# EAGLE design Logic Module V3 (EAGLE 9.5.1)
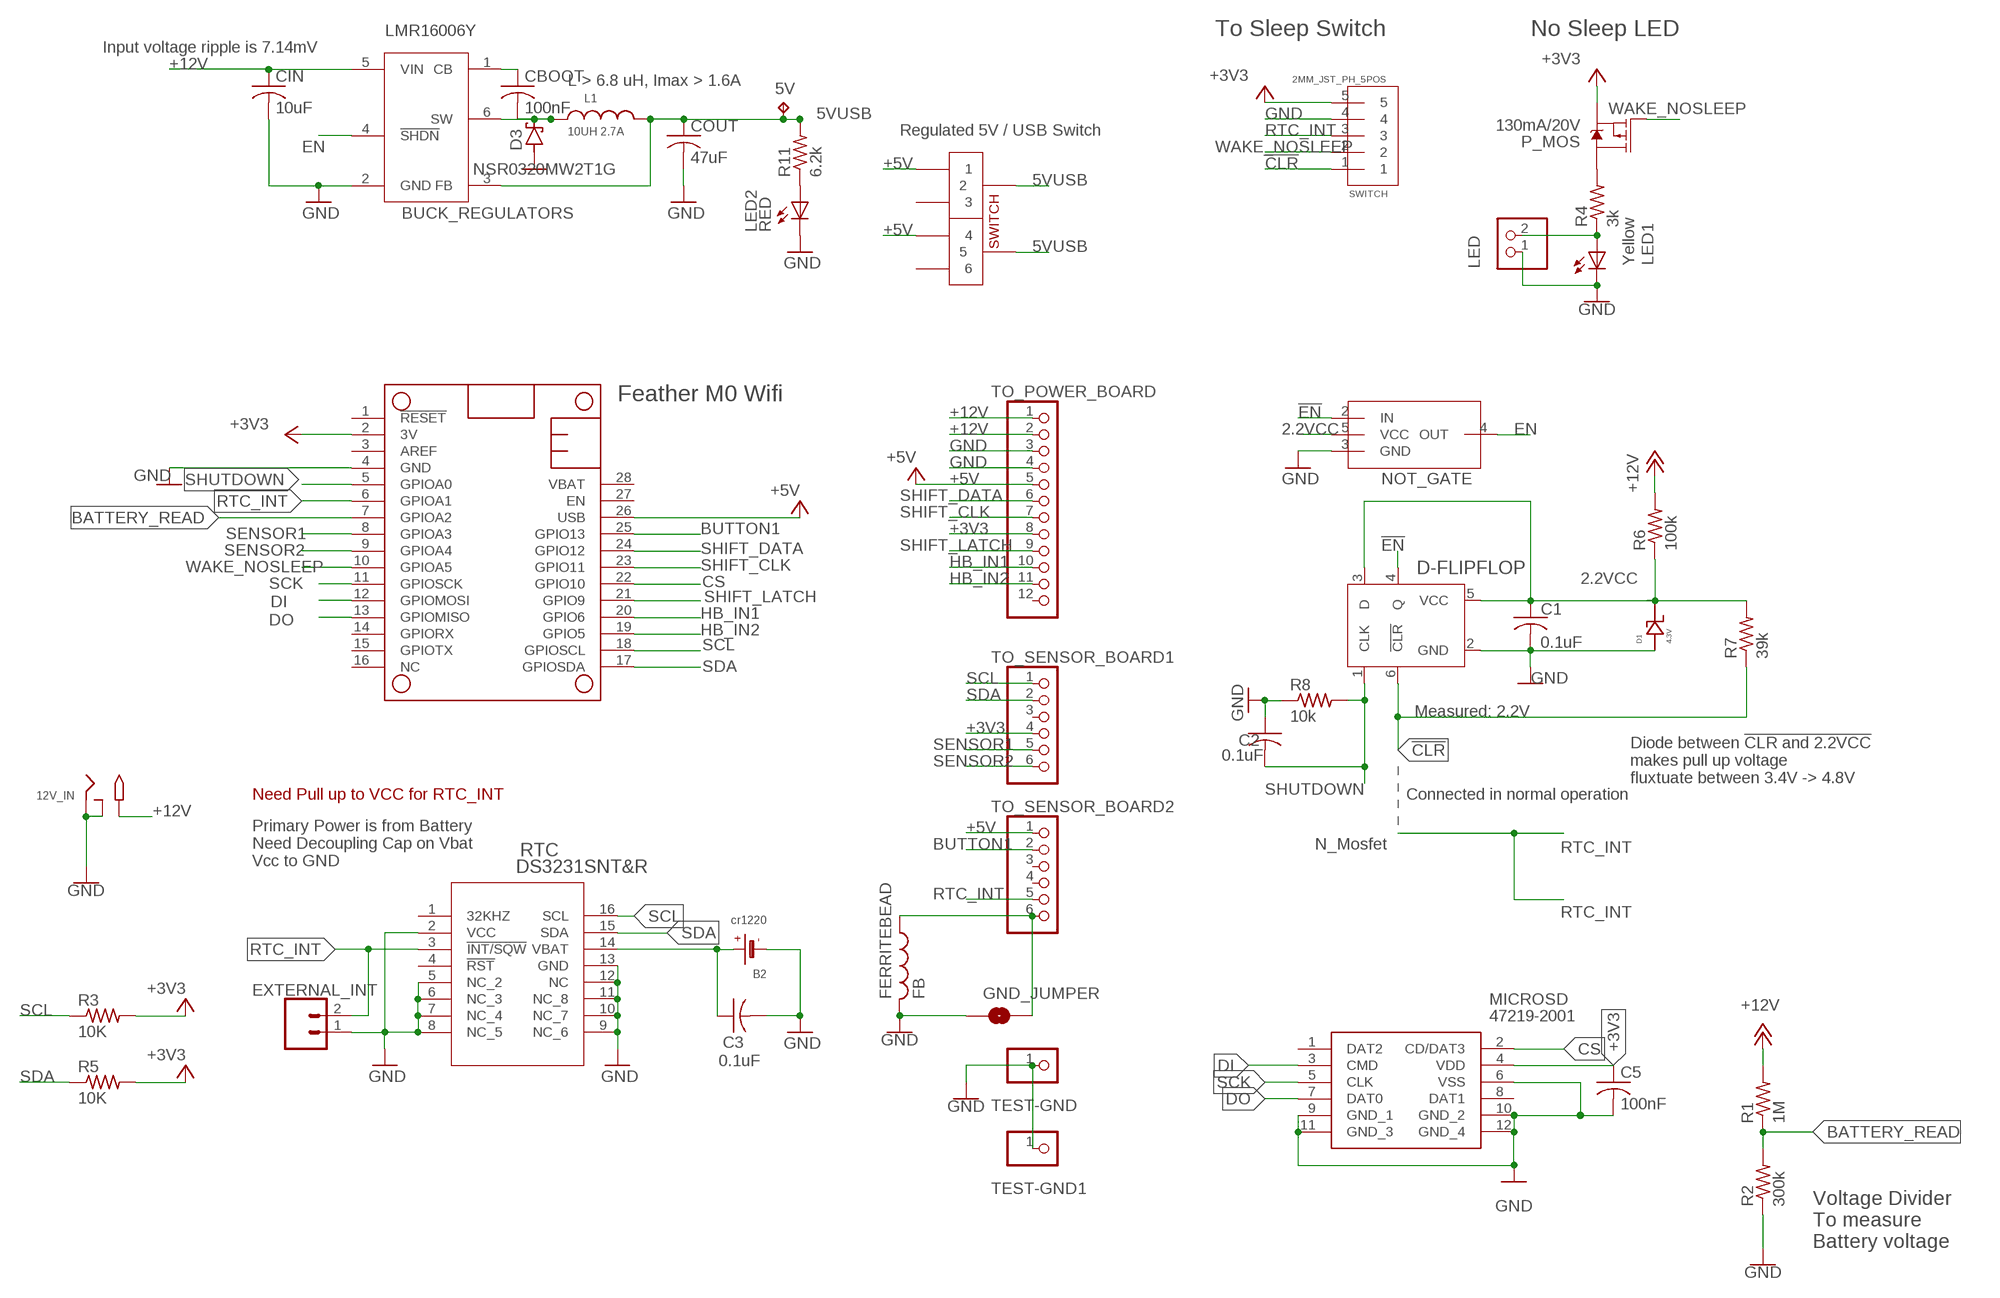
[diagram p0: schematic, sheet 1]

## Parts
5V  TPTP16R  [TP16R]
12V_IN  2.1MMJACKSMT  [DCJACK_2MM_SMT]
B2  cr1220  BATTERYCR1220_2  [CR1220-2]
C1  0.1uF  C-USC1206  [C1206]
C2  0.1uF  C-USC1206  [C1206]
C3  0.1uF  C-USC1206  [C1206]
C5  100nF  C-USC1206  [C1206]
CBOOT  100nF  C-USC1206  [C1206]
CIN  10uF  C-USC1206K  [C1206K]
COUT  47uF  C-USC1206  [C1206]
D1  4.3V  ZENER-DO219  [DO-219AC]
D3  NSR0320MW2T1G  BAT60J  [SOD323_ST]
D-FLIPFLOP  SN74LVC1G175DBVR  [DBV6]
EXTERNAL_INT  CONN_021X02_NO_SILK  [1X02_NO_SILK]
FERRITEBEAD  FB  [FB]
GND_JUMPER  JUMPER-SMT_2_NO_NO-SILK  [SMT-JUMPER_2_NO_NO-SILK]
L1  10UH 2.7A  WE-MAPI_4030_74438357100  [WE-MAPI_40XX]
LED  2.5MM_JST_UP_2POS  [JST_2POS_2.5MM_UP]
LED1  Yellow  LEDCHIPLED_0805  [CHIPLED_0805]
LED2  RED  LEDCHIPLED_0805  [CHIPLED_0805]
MICROSD  47219-2001  [472192001]
MS1  FEATHERWING  [FEATHERWING]
P_MOS  130mA/20V  MOSFET_PCH-IRLML2244  [SOT23-3]
R1  1M  R-US_R1206  [R1206]
R2  300k  R-US_R1206  [R1206]
R3  10K  R-US_R1206  [R1206]
R4  3k  R-US_R1206  [R1206]
R5  10K  R-US_R1206  [R1206]
R6  100k  R-US_R1206  [R1206]
R7  39k  R-US_R1206  [R1206]
R8  10k  R-US_R1206  [R1206]
R11  6.2k  WSLP1206R0500FEA  [RES_1206]
RTC  DS3231SNT&R  [21-0042B_16]
SWITCH  2MM_JST_PH_5POS  [2MM_5POS_HEADER]
TEST-GND  PINHD-1X1  [1X01]
TEST-GND1  PINHD-1X1  [1X01]
TO_POWER_BOARD  PINHD-1X12  [1X12]
TO_SENSOR_BOARD1  PINHD-1X6CB  [1X06-CLEANBIG]
TO_SENSOR_BOARD2  PINHD-1X6CB  [1X06-CLEANBIG]
U$1  2PDT_SWITCHJS-SMD  [JS-DPDT-SMD]
U$3  NOT_GATE  [SOT753]
VREG  BUCK_REGULATORS  [SOT23-6]

## Nets
2.2VCC [sig]: C1.1 D1.FNT D-FLIPFLOP.3(D) D-FLIPFLOP.5(VCC) R6.1 R7.2 U$3.5(VCC)
5VUSB: 5V.TP COUT.1 L1.2 R11.2 U$1.P$2 U$1.P$5 VREG.3(FB)
!CLR: D-FLIPFLOP.6(!CLR) R7.1 SWITCH.1
!EN: D-FLIPFLOP.4(Q) U$3.2(IN)
+3V3: C5.1 MICROSD.4(VDD) MS1.2(3V) P_MOS.2(S) R3.2 R5.2 SWITCH.5 TO_POWER_BOARD.8 TO_SENSOR_BOARD1.4
+5V: MS1.26(USB) TO_POWER_BOARD.5 TO_SENSOR_BOARD2.1 U$1.P$1 U$1.P$4
+12V [12v]: 12V_IN.PWR2(TIP) CIN.1 R1.2 R6.2 TO_POWER_BOARD.1 TO_POWER_BOARD.2 VREG.5(VIN)
BATTERY_READ: MS1.7(GPIOA2) R1.1 R2.2
BUTTON1: MS1.25(GPIO13) TO_SENSOR_BOARD2.2
CS: MICROSD.2(CD/DAT3) MS1.22(GPIO10)
DI: MICROSD.3(CMD) MS1.12(GPIOMOSI)
DO: MICROSD.7(DAT0) MS1.13(GPIOMISO)
EN: U$3.4(OUT) VREG.4(!SHDN)
GND: 12V_IN.GND(RING) 12V_IN.GNDBREAK(RING_SW) B2.- C1.2 C2.1 C3.2 C5.2 CIN.2 COUT.2 D1.BCK D3.A D-FLIPFLOP.2(GND) EXTERNAL_INT.1 FERRITEBEAD.P$2 GND_JUMPER.1 LED1.C LED2.C LED.1 MICROSD.6(VSS) MICROSD.9(GND_1) MICROSD.10(GND_2) MICROSD.11(GND_3) MICROSD.12(GND_4) MS1.4(GND) R2.1 R8.1 RTC.2(VCC) RTC.5(NC_2) RTC.6(NC_3) RTC.7(NC_4) RTC.8(NC_5) RTC.9(NC_6) RTC.10(NC_7) RTC.11(NC_8) RTC.12(NC) RTC.13(GND) SWITCH.4 TEST-GND1.1 TEST-GND.1 TO_POWER_BOARD.3 TO_POWER_BOARD.4 U$3.3(GND) VREG.2(GND)
HB_IN1: MS1.20(GPIO6) TO_POWER_BOARD.10
HB_IN2: MS1.19(GPIO5) TO_POWER_BOARD.11
N$1: B2.+ C3.1 RTC.14(VBAT)
N$2: P_MOS.3(D) R4.2
N$3: LED1.A LED.2 R4.1
N$6: FERRITEBEAD.P$1 GND_JUMPER.2 TO_SENSOR_BOARD2.6
N$12: LED2.A R11.1
N$16: CBOOT.1 VREG.1(CB)
N$17: CBOOT.2 D3.C L1.1 VREG.6(SW)
RTC_INT: EXTERNAL_INT.2 MS1.6(GPIOA1) RTC.3(!INT/SQW) SWITCH.3 TO_SENSOR_BOARD2.5
SCK: MICROSD.5(CLK) MS1.11(GPIOSCK)
SCL: MS1.18(GPIOSCL) R3.1 RTC.16(SCL) TO_SENSOR_BOARD1.1
SDA: MS1.17(GPIOSDA) R5.1 RTC.15(SDA) TO_SENSOR_BOARD1.2
SENSOR1: MS1.8(GPIOA3) TO_SENSOR_BOARD1.5
SENSOR2: MS1.9(GPIOA4) TO_SENSOR_BOARD1.6
SHIFT_CLK: MS1.23(GPIO11) TO_POWER_BOARD.7
SHIFT_DATA: MS1.24(GPIO12) TO_POWER_BOARD.6
SHIFT_LATCH: MS1.21(GPIO9) TO_POWER_BOARD.9
SHUTDOWN: C2.2 D-FLIPFLOP.1(CLK) MS1.5(GPIOA0) R8.2
WAKE_NOSLEEP: MS1.10(GPIOA5) P_MOS.1(G) SWITCH.2
Unconnected: MICROSD.1(DAT2) MICROSD.8(DAT1) MS1.1(!RESET) MS1.3(AREF) MS1.14(GPIORX) MS1.15(GPIOTX) MS1.16(NC) MS1.27(EN) MS1.28(VBAT) RTC.1(32KHZ) RTC.4(!RST) TO_POWER_BOARD.12 TO_SENSOR_BOARD1.3 TO_SENSOR_BOARD2.3 TO_SENSOR_BOARD2.4 U$1.P$3 U$1.P$6

## Notes on the sheet
- To Sleep Switch | No Sleep LED
- Input voltage ripple is 7.14mV
- L > 6.8 uH, Imax > 1.6A
- Regulated 5V / USB Switch
- Feather M0 Wifi
- Measured: 2.2V
- Diode between !CLR and 2.2VCC
  makes pull up voltage 
  fluxtuate between 3.4V -> 4.8V
- Need Pull up to VCC for RTC_INT | Connected in normal operation
- N_Mosfet
- Primary Power is from Battery
  Need Decoupling Cap on Vbat
  Vcc to GND
- Voltage Divider
  To measure 
  Battery voltage

## Library data of the parts
5V = testpad:TP: Test pad
12V_IN = adafruit:2.1MMJACK: 2.1mm x 5.5mm THM DC jack with internal switch. Digikey part #PJ-102A, 4UCON part #05537 2.1mm x 5.5mm SMT DC jack with internal switch. Digikey part #PJ-002A-SMT, 4UCON part #03267 By microbuilder.eu & adafruit.com
B2 = microbuilder:BATTERY: CR1220 SMT - Digikey: 3001K-ND CD2032 BAT-HLD-001 - Digikey: BAT-HLD-001-ND
C1-C3 = adafruit:C-US: CAPACITOR, American symbol
C5 = resistor:C-US: CAPACITOR, American symbol
CBOOT CIN COUT = rcl:C-US: CAPACITOR, American symbol; SPICEPREFIX: C
D1 = beach:ZENER-DO219
D3 = diode:BAT60J: Schottky barrier diode Source: www.st.com, BAT60J.pdf
D-FLIPFLOP = eDNA:SN74LVC1G175DBVR: D Flipflop with clear - https://www.digikey.com/product-detail/en/texas-instruments/SN74LVC1G175DBVR/296-17617-1-ND/706599; MANUFACTURER_PART_NUMBER: SN74LVC1G175DBVR; VENDOR: Texas Instruments
EXTERNAL_INT = SparkFun-Connectors:CONN_02: Multi connection point. Often used as Generic Header-pin footprint for 0.1 inch spaced/style header connections On any of the 0.1 inch spaced packages, you can populate with these: Break Away Headers - Straight <https://www.sparkfun.com/products/116> (PRT-00116) Break Away Male Headers - Right Angle <https://www.sparkfun.com/products/553> (PRT-00553) Female Headers <https://www.sparkfun.com/products/115> (PRT-00115) Break Away Headers - Machine Pin <https://www.sparkfun.com/products/117> (PRT-00117) Break Away Female Headers - Swiss Machine Pin <https://www.sparkfun.com/products/743> (PRT-00743) For SCREWTERMINALS and SPRING TERMINALS visit here: Screw Terimnals on SparkFun.com <https://www.sparkfun.com/search/results?term=Screw+Terminals> (5mm/3.5mm/2.54mm spacing) This device is also useful as a general connection point to wire up your design to another part of your project. Our various solder wires solder well into these plated through hole pads. Hook-Up Wire - Assortment (Stranded, 22 AWG) <https://www.sparkfun.com/products/11375> (PRT-11375) Hook-Up Wire - Assortment (Solid Core, 22 AWG) <https://www.sparkfun.com/products/11367> (PRT-11367) View the entire wire category on our website here <https://www.sparkfun.com/categories/141> Special notes: Molex polarized connector foot print use with: PRT-08233 with associated crimp pins and housings. 2.54_SCREWTERM for use with PRT-10571. 3.5mm Screw Terminal footprints for PRT-08084 5mm Screw Terminal footprints for use with PRT-08432
FERRITEBEAD = adafruit:FB: Ferrite bead Digikey #P9821BK-ND
GND_JUMPER = SparkFun-Jumpers:JUMPER-SMT_2_NO: Normally open jumper This jumper has two pads in close proximity to each other. Apply solder to close the connection. Round pads are easier to solder for beginners, but are a lot larger. SparkFun Product that uses the round pads: SparkFun EL Sequencer <https://www.sparkfun.com/products/12781>
L1 = EMCComponents (rev19e):WE-MAPI_4030: SMD Metal Alloy Power Inductor Characteristics Magnetic iron alloy allows high rated currents Compact design Magnetically shielded High current capability and handles high transient current spikes Low acoustic noise and low leakage flux noise Operating temperature: –40 °C to 125 °C Applications DC/DC-converter for high current power supplies DC/DC-converter for Field Programmable Gate Array (FPGA) POL-converters Portable power like PDA, digital camera Mainboards/graphic cards Battery powered devices Wireless communication devices Power supplies for smartphones, tablet PCs and other mobile devices <http://katalog.we-online.de/media/images/v2/Family_WE-MAPI.jpg> Details see: http://katalog.we-online.de/en/pbs/WE-MAPI? Updated by Dan Xu 2014-07-08 2014 (C) Wurth Elektronik; WE-NUMBER: 74438357100/10uH
LED = eDNA:2.5MM_JST_UP_2POS
LED1 LED2 = adafruit:LED: LED OSRAM: - CHIPLED LG R971, LG N971, LY N971, LG Q971, LY Q971, LO R971, LY R971 LH N974, LH R974 LS Q976, LO Q976, LY Q976 LO Q996 - Hyper CHIPLED LW Q18S LB Q993, LB Q99A, LB R99A - SideLED LS A670, LO A670, LY A670, LG A670, LP A670 LB A673, LV A673, LT A673, LW A673 LH A674 LY A675 LS A676, LA A676, LO A676, LY A676, LW A676 LS A679, LY A679, LG A679 - Hyper Micro SIDELED® LS Y876, LA Y876, LO Y876, LY Y876 LT Y87S - SmartLED LW L88C, LW L88S LB L89C, LB L89S, LG L890 LS L89K, LO L89K, LY L89K LS L896, LA L896, LO L896, LY L896 - TOPLED LS T670, LO T670, LY T670, LG T670, LP T670 LSG T670, LSP T670, LSY T670, LOP T670, LYG T670 LG T671, LOG T671, LSG T671 LB T673, LV T673, LT T673, LW T673 LH T674 LS T676, LA T676, LO T676, LY T676, LB T676, LH T676, LSB T676, LW T676 LB T67C, LV T67C, LT T67C, LS T67K, LO T67K, LY T67K, LW E67C LS E67B, LA E67B, LO E67B, LY E67B, LB E67C, LV E67C, LT E67C LW T67C LS T679, LY T679, LG T679 LS T770, LO T770, LY T770, LG T770, LP T770 LB T773, LV T773, LT T773, LW T773 LH T774 LS E675, LA E675, LY E675, LS T675 LS T776, LA T776, LO T776, LY T776, LB T776 LHGB T686 LT T68C, LB T68C - Hyper Mini TOPLED® LB M676 - Mini TOPLED Santana® LG M470 LS M47K, LO M47K, LY M47K Source: http://www.osram.convergy.de/
MICROSD = SamacSys_Parts:47219-2001: Molex 47219 Series 8 Way Horizontal Hinged Micro SD Memory Card Connector with Solder Termination Source: Datasheet <https://componentsearchengine.com/Datasheets/1/47219-2001.pdf>; DESCRIPTION: Molex 47219 Series 8 Way Horizontal Hinged Micro SD Memory Card Connector with Solder Termination; HEIGHT: mm; MANUFACTURER_NAME: Molex; MANUFACTURER_PART_NUMBER: 47219-2001; MOUSER_PART_NUMBER: 538-47219-2001; MOUSER_PRICE-STOCK: https://www.mouser.com/Search/Refine.aspx?Keyword=538-47219-2001
MS1 = adafruit:FEATHERWING
P_MOS = SparkFun-DiscreteSemi:MOSFET_PCH: P-channel MOSFETs Voltage controlled devices that allow control of high current outputs. SparkFun Products: SparkFun ESP32 Thing <https://www.sparkfun.com/products/13907> SparkFun ESP8266 Thing <https://www.sparkfun.com/products/13231>; PROD_ID: TRANS-11153; VALUE: 4.3A/20V/54mΩ
R1 R2 R6-R8 = adafruit:R-US_: RESISTOR, American symbol
R3 R5 = rcl:R-US_: RESISTOR, American symbol; SPICEPREFIX: R
R4 = resistor:R-US_: RESISTOR, American symbol
R11 = Resistor_Capacitor:WSLP1206R0500FEA: RES 0.05 OHM 1% 1W 1206 Manufacturer's datasheet <http://www.vishay.com/docs/30122/wslp.pdf>; CREATED_BY: PCBLayout.com; DIGIKEY_PART_NUMBER: WSLP-.05TR-ND; MANUFACTURER: Vishay Dale; MPN: WSLP1206R0500FEA; PACKAGE: SMD 1206
RTC = eDNA:DS3231SNT&R: Real-time clock, RTC, DS3231 https://www.digikey.com/products/en?keywords=DS3231SN%23T%26RCT-ND; MANUFACTURER_PART_NUMBER: DS3231SN#T&R; VENDOR: Maxim Integrated Products
SWITCH = eDNA:2MM_JST_PH_5POS: 5POS JST female, 5 position https://www.digikey.com/product-detail/en/jst-sales-america-inc/B5B-PH-K-S-LF-SN/455-1707-ND/926614
TEST-GND TEST-GND1 = adafruit:PINHD-1X1: Pin header 1x1 for 0.1" spacing With round pins
TO_POWER_BOARD = adafruit:PINHD-1X12: PIN HEADER
TO_SENSOR_BOARD1 TO_SENSOR_BOARD2 = adafruit:PINHD-1X6: PIN HEADER
U$1 = eDNA:2PDT_SWITCH: Double Pole Double Throw ON OFF ON switch. https://www.digikey.com/product-detail/en/e-switch/100DP1T1B1M2QEH/EG2400-ND/378869
U$3 = eDNA:NOT_GATE: Logic INVERTER, also known as NOT gate. SOT753 footprint. SOT753 version can be ordered from https://www.digikey.com/product-detail/en/toshiba-semiconductor-and-storage/TC4S584FLF/TC4S584FLFCT-ND/870444 Bao Nguyen - OpenSensingLab
VREG = eDNA:BUCK_REGULATORS

## Net classes
0 default: clearance 0.2 mm
1 12v: width 0.356 mm, clearance 0.254 mm
2 5v: width 0.406 mm, clearance 0.2 mm
3 sig: width 0.152 mm, clearance 0.2 mm

## Board
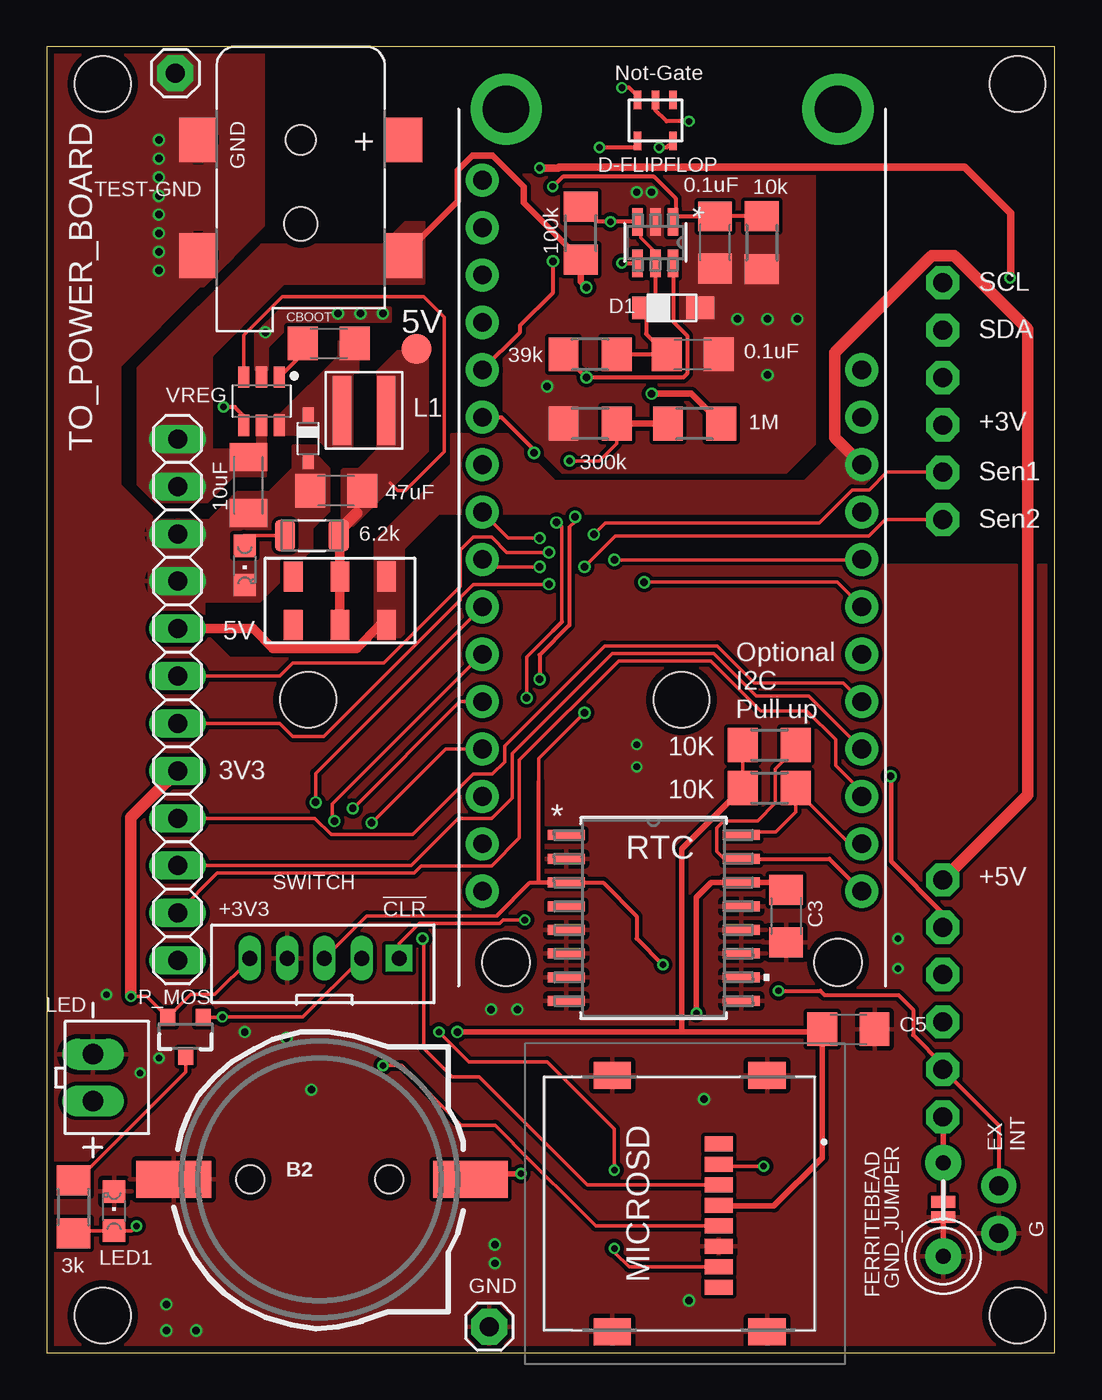
[diagram p1: board, top side]
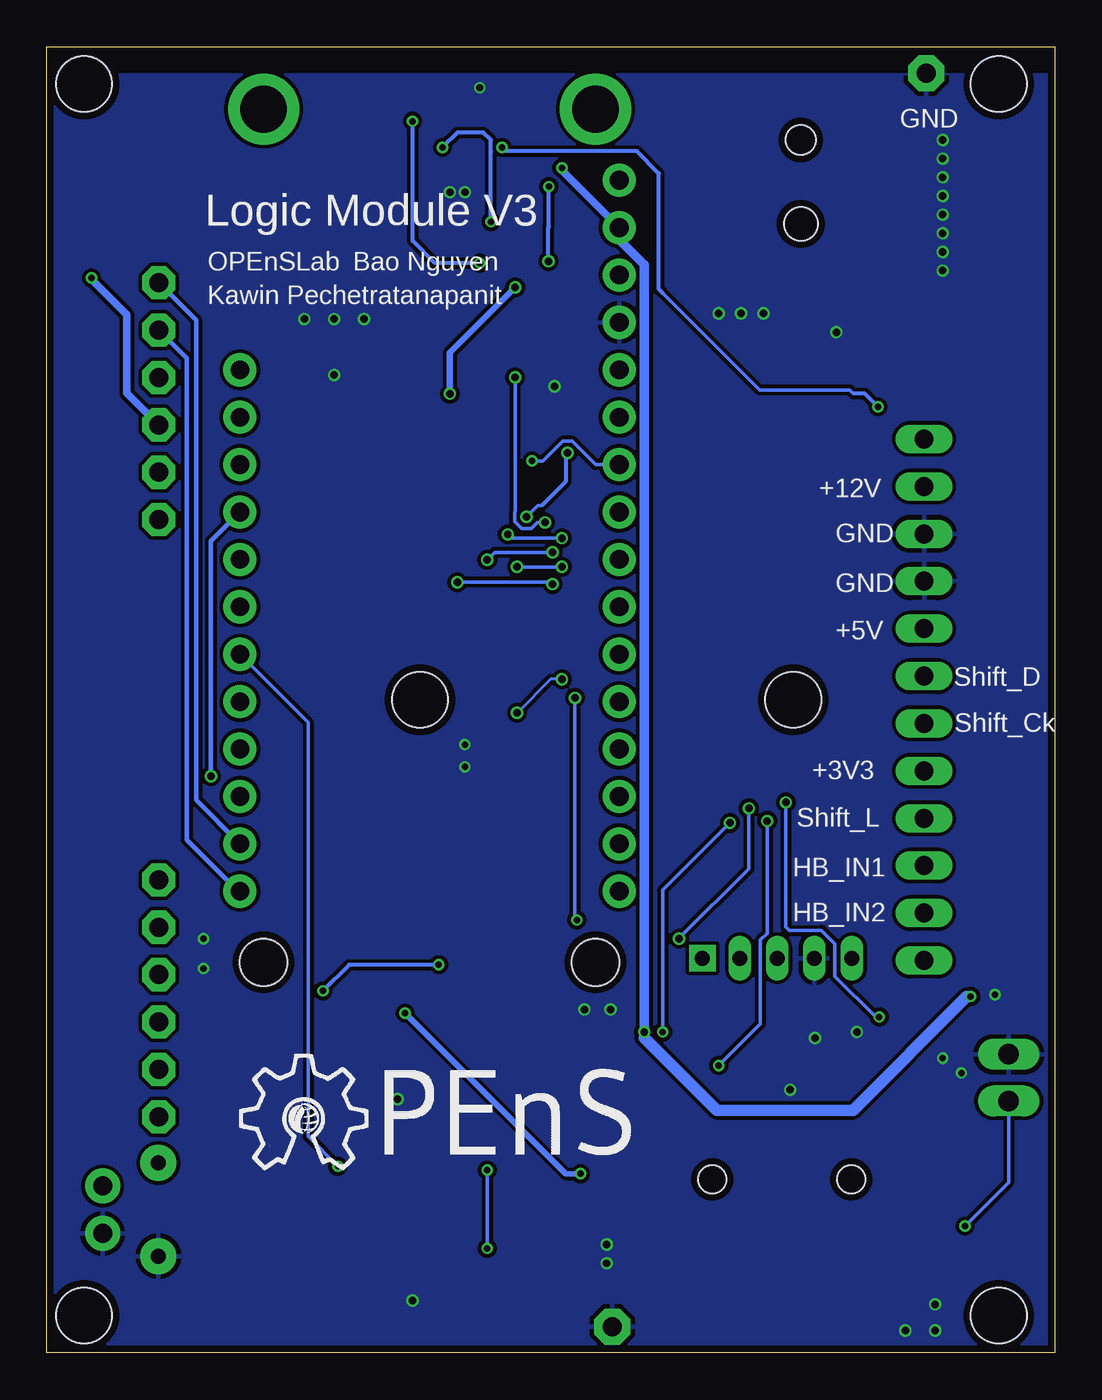
[diagram p2: board, bottom side, seen from below]

Size 54 x 70 mm. Coordinates in mm from the lower left corner, seen from the top.
Outline: 0,0 54,0 54,70 0,70 0,0
Copper layers (1*16): Top 0.035559375mm / dielectric 1.6mm / Bottom 0.035559375mm
Design rules "oshpark-2layer *": minimum track width 6mil, minimum drill 10mil, track to track 6mil, track to pad 6mil, pad to pad 6mil, via to via 6mil, smd to smd 6mil, copper to edge 15mil, drill to drill 6mil, minimum pad ring 5mil, minimum via ring 5mil, stop-mask expansion 2.5mil, vias tented up to drill 30mil, thermal gap 10mil
Holes 3 mm at 3,2 52,68 52,2 14,35 34,35 3,68

### Footprints (pad centres in the part's own frame; a part is rotated, then mirrored left to right if it is on the bottom)
TP16R = smd 1.6 x 1.6: TP 0,0
DCJACK_2MM_SMT = smd 2.4 x 2: GND 0,-5.5; GNDBREAK 6.2,-5.5; PWR1 0,5.5; PWR2 6.2,5.5 | hole 1.6: 0,0 | hole 1.8: 4.5,0
CR1220-2 = smd 4 x 2: + 8.29,0; - -7.6,0 | hole 1.5: 3.95,0; -3.5,0
C1206 = smd 1.6 x 1.8: 1 -1.4,0; 2 1.4,0
C1206K = smd 1.5 x 2: 1 -1.5,0; 2 1.5,0
DO-219AC = smd 1.5 x 1.2: BCK 2.9,0; FNT 0,0
SOD323_ST = smd 0.8 x 0.6: A 1.25,0; C -1.25,0
DBV6 = smd 1.473 x 0.559: 1 -1.118,0.95; 2 -1.118,0; 3 -1.118,-0.95; 4 1.118,-0.95; 5 1.118,0; 6 1.118,0.95
1X02_NO_SILK = drill 1.016 pad 1.88: 1 0,0; 2 2.54,0
FB = drill 0.8 pad 1.93: P$1 -2.5,0; P$2 2.5,0
SMT-JUMPER_2_NO_NO-SILK = smd 0.635 x 1.27: 1 -0.406,0; 2 0.406,0
WE-MAPI_40XX = smd 0.98 x 3.7: 1 -1.185,0; 2 1.185,0
JST_2POS_2.5MM_UP = drill 1.1 long: 1 -1.25,0; 2 1.25,0
CHIPLED_0805 = smd 1.2 x 1.2: A 0,-1.05; C 0,1.05
472192001 = smd 0.8 x 1.5: 1 3.205,-1.8; 2 2.105,-1.8; 3 1.005,-1.8; 4 -0.095,-1.8; 5 -1.195,-1.8; 6 -2.295,-1.8; 7 -3.395,-1.8; 8 -4.495,-1.8 | smd 1.45 x 2: 9 -6.875,-4.4; 10 -6.875,3.9; 11 6.875,3.9; 12 6.875,-4.4
FEATHERWING = drill 1 pad 1.778: 1 6.35,1.27; 2 8.89,1.27; 3 11.43,1.27; 4 13.97,1.27; 5 16.51,1.27; 6 19.05,1.27; 7 21.59,1.27; 8 24.13,1.27; 9 26.67,1.27; 10 29.21,1.27; 11 31.75,1.27; 12 34.29,1.27; 13 36.83,1.27; 14 39.37,1.27; 15 41.91,1.27; 16 44.45,1.27; 17 44.45,21.59; 18 41.91,21.59; 19 39.37,21.59; 20 36.83,21.59; 21 34.29,21.59; 22 31.75,21.59; 23 29.21,21.59; 24 26.67,21.59; 25 24.13,21.59; 26 21.59,21.59; 27 19.05,21.59; 28 16.51,21.59 | drill 2.5 pad 3.81: P$1 2.54,20.32; P$2 2.54,2.54 | hole 2.54: 48.26,20.32; 48.26,2.54
SOT23-3 = smd 0.8 x 0.9: 1 -0.95,-1; 2 0.95,-1; 3 0,1.1
R1206 = smd 1.6 x 1.803: 1 -1.422,0; 2 1.422,0
RES_1206 = smd 1.08 x 1.68: 1 -1.445,0; 2 1.445,0
21-0042B_16 = smd 1.981 x 0.533: 1 -4.686,4.445; 2 -4.686,3.175; 3 -4.686,1.905; 4 -4.686,0.635; 5 -4.686,-0.635; 6 -4.686,-1.905; 7 -4.686,-3.175; 8 -4.686,-4.445; 9 4.686,-4.445; 10 4.686,-3.175; 11 4.686,-1.905; 12 4.686,-0.635; 13 4.686,0.635; 14 4.686,1.905; 15 4.686,3.175; 16 4.686,4.445
2MM_5POS_HEADER = drill 0.8 pad 1.422 square: 1 -4,0 | drill 0.8 long: 2 -2,0; 3 0,0; 4 2,0; 5 4,0
1X01 = drill 1.016 pad 1.93 octagon: 1 0,0
1X12 = drill 1.016 long: 1 -13.97,0; 2 -11.43,0; 3 -8.89,0; 4 -6.35,0; 5 -3.81,0; 6 -1.27,0; 7 1.27,0; 8 3.81,0; 9 6.35,0; 10 8.89,0; 11 11.43,0; 12 13.97,0
1X06-CLEANBIG = drill 1.016 pad 1.778 octagon: 1 -6.35,0; 2 -3.81,0; 3 -1.27,0; 4 1.27,0; 5 3.81,0; 6 6.35,0
JS-DPDT-SMD = smd 1 x 1.6: P$1 0,0; P$2 2.5,0; P$3 5,0; P$4 0,2.6; P$5 2.5,2.6; P$6 5,2.6
SOT753 = smd 1 x 0.4: 1 -1.14,0.95; 2 -1.14,0; 3 -1.14,-0.95; 4 1.06,-0.95; 5 1.06,0.95
SOT23-6 = smd 1.146 x 0.597: 1 -1.287,0.95; 2 -1.287,0; 3 -1.287,-0.95; 4 1.287,-0.95; 5 1.287,0; 6 1.287,0.95

### Placement (x,y rotation side)
5V  19.8,53.8 0 top
12V_IN  13.6,65 270 top
B2  14.4,9.3 0 top
C1  34.6,53.5 0 top
C2  35.8,59.5 90 top
C3  39.6,23.4 270 top
C5  42.94,17.34 0 top
CBOOT  15.1,54.1 0 top
CIN  10.8,46.5 270 top
COUT  15.5,46.2 180 top
D1  32.1,56 0 top
D3  14,49 270 top
D-FLIPFLOP  32.6,59.5 270 top
EXTERNAL_INT  51,6.4 90 top
FERRITEBEAD  48.02,7.68 270 top
GND_JUMPER  48.02,7.68 90 top
L1  17,50.5 0 top
LED  2.46,14.75 270 top
LED1  3.6,7.6 0 top
LED2  10.6,42.2 180 top
MICROSD  34.19,8 90 top
MS1  22.06,69.19 270 top
P_MOS  7.43,16.97 180 top
R1  34.7,49.8 0 top
R2  29.1,49.8 0 top
R3  38.7,30.27 180 top
R4  1.42,7.82 90 top
R5  38.7,32.57 180 top
R6  28.6,60 270 top
R7  29.1,53.5 0 top
R8  38.3,59.5 90 top
R11  14.2,43.8 0 top
RTC  32.5,23.3 0 top
SWITCH  14.87,21.15 180 top
TEST-GND  6.88,68.58 90 top
TEST-GND1  23.7,1.4 0 top
TO_POWER_BOARD  7,35 270 top
TO_SENSOR_BOARD1  48,51 270 top
TO_SENSOR_BOARD2  48,19 270 top
U$1  18.2,41.6 180 top
U$2  [OPENS-LOGO]  43.92,6.09 0 bottom
U$3  32.6,66 270 top
VREG  11.5,51 270 top

### Tracks (layer width: path | path; a pad name or v marks a point on that pad's centre or on a via)
2.2VCC  (via drill 0.35)
  Top 0.2: D-FLIPFLOP.3 31.82,60.45 31.82,59.76 32.6,58.98 D-FLIPFLOP.5
  Top 0.203: D-FLIPFLOP.5 32.6,56.5 D1.FNT 32.1,54.6 C1.1 R7.2 | R6.1 29.4,60.62 v30.2,60.62 D-FLIPFLOP.3 | v32.8,64.6 33.21,64.6 U$3.5
  Bottom 0.203: v30.2,60.62 30.2,64.35 30.2,65 30.6,65.4 32,65.4 v32.8,64.6
5VUSB
  Top 0.2: VREG.3 10.55,54.55 12.6,56.6 20.2,56.6 21.3,55.5 21.3,48.3 19.2,46.2 18.8,46.2 18.4,46.6
  Top 0.406: 15.7,43.74 R11.2
  Top 0.508: 15.7,43.74 U$1.P$2 U$1.P$5 | 16.9,45.6 COUT.1
  Top 0.61: R11.2 15.64,44.05 16.6,45
  pour Top (no thermals): 17.7,52.6 18.8,53.7 20.4,53.7 20.4,48.3 16.4,44.3 15.8,44.3 15.8,47.3 15.9,47.4 16.7,47.4 17.7,48.4
!CLR  (via drill 0.35, 0.4)
  Top 0.2: 27.59,39.17 27.59,44.29 27.51,44.29 v27.3,44.5 | 27.11,38.69 25.7,37.28 v25.7,35.1 | v25.6,23.2 24.44,23.2 24.27,23.02 19.94,23.02 18.87,21.95 SWITCH.1
  Top 0.203: D-FLIPFLOP.6 33.55,55.28 34.3,54.52 34.3,52.48 34.1,52.27 v28.91,52.27 R7.1 | 27.59,39.17 27.11,38.69
  Bottom 0.2: v25.7,35.1 25.7,23.5 25.6,23.4 v25.6,23.2 | v27.3,44.5 27.71,44.5 28.04,44.17 28.56,44.17 28.93,44.54 28.93,45.06 28.91,45.08 v28.91,52.27
!EN  (via drill 0.35)
  Top 0.203: D-FLIPFLOP.4 30.82,58.38 v30.8,58.4 | v34.4,66 33.2,66 32.6,66.6 U$3.2
  Bottom 0.203: v30.8,58.4 33.2,58.4 34.4,59.6 v34.4,66
+3V3  (via drill 0.35, 0.4)
  Top 0.2: R3.2 R5.2 | v4.5,19.1 5.35,19.1 P_MOS.2 7.71,19.2 9,19.2 10.87,21.07 SWITCH.5
  Top 0.305: v21.99,17.2 34,17.2 | 34,17.2 41.4,17.2 C5.1 41.54,10.46 38.95,7.87 36.02,7.87 MICROSD.4 | R3.2 34,27 34,17.2
  Top 0.406: v26.4,63.5 27.39,63.5 27.41,63.53 49.17,63.53 51.63,61.07 51.63,57.63 v51.6,57.6
  Top 0.61: TO_POWER_BOARD.8 5.73,29.92 5.71,29.92 4.5,28.7 v4.5,19.1
  Bottom 0.406: MS1.2 26.4,63.37 v26.4,63.5 | v51.6,57.6 51.6,57.53 49.7,55.63 49.7,51.43 TO_SENSOR_BOARD1.4
  Bottom 0.508: MS1.2 23.33,59.66 21.99,58.32 v21.99,17.2 21.99,16.89
  Bottom 0.61: 21.99,16.89 18.1,13 10.8,13 4.7,19.1 v4.5,19.1
+5V
  Top 0.508: TO_POWER_BOARD.5 11.05,38.81 12.11,37.75 16.59,37.75 17.84,39 U$1.P$4
  Top 0.61: TO_SENSOR_BOARD2.1 52.55,29.89 52.55,54.85 48.6,58.8 47.4,58.8 42.9,54.3 42.2,53.6 42.2,49.05 MS1.26
  pour Top (no thermals): 17.6,38.4 17.6,43.5 21.7,47.6 21.7,49.2 24.7,49.2 27.2,46.7 40.6,46.7 42.7,48.8 44.2,47.3 44.2,47 42.2,45 21,45 19.1,43.1 19.1,38.4
+12V  (via drill 0.4)
  Top 0.356: 12V_IN.PWR2 22.01,61.71 22.01,63.39 22.78,64.16 23.88,64.16 25.55,62.49 25.55,61.63 R6.2 28.6,57.4 v28.9,57.1 | v32.4,51.4 34.52,51.4 R1.2
  Bottom 0.356: v28.9,57.1 32.4,53.6 v32.4,51.4
  pour Top (no thermals): 20.2,60.6 20.2,57.3 12.7,57.3 8.8,53.4 8.8,48.4 11.1,48.4 11.3,48.6 11.3,49.7 11.7,49.7 11.7,46.98 9.98,46.98 8.6,45.6 5.8,45.6 4.9,46.5 4.9,52.8 11.5,59.4 18,59.4 19.2,60.6
BATTERY_READ  (via drill 0.35)
  Top 0.2: v28,47.8 29.6,47.8 30.52,48.72 R2.2
  Top 0.356: R2.2 R1.1
  Bottom 0.2: MS1.7 24.59,47.6 25.84,48.85 26.36,48.85 27.41,47.8 v28,47.8
BUTTON1  (via drill 0.4)
  Top 0.254: TO_SENSOR_BOARD2.2 48,23.55 45.23,26.32 45.23,30.87 v45.2,30.9
  Bottom 0.254: MS1.25 45.2,43.51 v45.2,30.9
CS  (via drill 0.35)
  Top 0.2: v38.4,10 36.09,10 MICROSD.2
  Bottom 0.2: MS1.22 40,33.79 40,11.6 v38.4,10
DI  (via drill 0.4)
  Top 0.2: MS1.12 22.13,34.9 16.41,29.18 v16.39,29.18 | v20.13,22.2 20.2,22.13 20.2,16.31 21.7,14.8 23.17,14.8 28.96,9.01 MICROSD.3
  Bottom 0.2: v20.13,22.2 16.39,25.94 v16.39,29.18
DO  (via drill 0.35, 0.4)
  Top 0.2: v17.4,28.4 21.36,32.36 MS1.13 | v21,17.2 22.6,15.6 26.8,15.6 30.4,12 v30.4,9.8 | MICROSD.7 31.2,4.61 30.4,5.4 v30.4,5.6
  Bottom 0.2: v17.4,28.4 21,24.8 v21,17.2 | v30.4,9.8 v30.4,5.6
EN  (via drill 0.35)
  Top 0.203: VREG.4 10.55,50.21 10.07,50.69 v9.46,50.69 | v29.6,64.6 31.51,64.6 31.65,64.74 U$3.4
  Bottom 0.2: 10.78,51.42 10.97,51.6 15.8,51.6 21,56.8
  Bottom 0.203: 10.78,51.42 10.18,51.42 v9.46,50.69 | 21,56.8 21.2,57 21.2,63.2 22.4,64.4 29.4,64.4 v29.6,64.6
GND  (via drill 0.35, 0.4)
  Top 0.203: U$3.3 31.65,67.34 31.19,67.8 v30.8,67.8
  Top 0.305: GND_JUMPER.1 FERRITEBEAD.P$2
  other vias: 11.7,54.7 15.6,55.7 16.8,55.7 18,55.7 37,55.4 38.6,55.4 40.2,55.4 38.6,52.4 31.6,62.2 32.4,62.2 6,65 6,64 6,62 6,61 6,60 6,59 6,63 6,58 26.8,51.8 12.84,16.87 10.6,17.2 24,4.8 24,5.8 23.8,18.4 25.2,18.4 34.4,2.8 35.2,13.6 6.4,1.2 8,1.2 6.4,2.6 14.17,14.1 3.2,19.2 6,15.8 5,15 45.6,22.2 45.6,20.6 31.6,32.6 31.6,31.4
  pour Top (no thermals): 11.2,52.7 11.2,54.6 12.6,56 18.4,56 18.4,55.3 13.2,55.3 11.8,53.9 11.8,52.7
  pour Bottom: 0,68.5 54.2,68.5 54.2,0.6 53.8,0.2 0,0.2
  pour Top (no thermals): 5.41,44.59 8.69,44.59 10.2,46.1 11.9,46.1 13.2,47.4 13.2,48.6 14.4,48.6 14.4,48.1 15.1,47.4 15.1,45.1 14.2,44.2 14.2,43.1 11.4,40.3 5.5,40.3
  pour Top (no thermals): 24.5,62.7 24.5,50.3 25.6,49.2 27.6,47.2 39.6,47.2 41.1,48.7 41.1,63.1 24.9,63.1
  pour Top: 3.93,46.47 0,42.54 0,0.2 0.2,0 54.2,0 54.2,42 54,42.2 24.4,42.2 19.4,37.2 9.8,37.2 8.4,38.6 8.4,44.62 5.78,44.62
  pour Top (no thermals): 0,69.8 11.4,69.8 11.6,70 11.6,60.4 8.4,57.2 8.2,57.2 3.89,52.89 3.89,42.89 0.8,39.8 0,39.8
HB_IN1
  Top 0.2: TO_POWER_BOARD.10 19.51,26.11 22.03,28.63 23.82,28.63 24.92,29.73 24.92,32.12 30.28,37.48 35.72,37.48 38,35.2 40.81,35.2 MS1.20
HB_IN2
  Top 0.2: TO_POWER_BOARD.11 9.14,25.71 19.68,25.71 20.06,26.09 23.82,26.09 25.32,27.59 25.32,31.77 30.63,37.08 35.55,37.08 38.24,34.4 40.72,34.4 42.26,32.86 42.26,31.47 43.65,30.08 MS1.19
N$1  (via drill 0.35)
  Top 0.305: v34.8,18.2 34.8,24.4 35.6,25.2 RTC.14 39.2,25.2 C3.1 | v25.4,9.6 22.99,9.6 B2.+
  Bottom 0.305: v34.8,18.2 26.2,9.6 v25.4,9.6
N$2
  Top 0.2: P_MOS.3 7.44,15.86 7.44,15.07 1.62,9.24 R4.2
N$3  (via drill 0.35)
  Top 0.2: R4.1 1.57,6.55 LED1.A 4.55,6.55 v4.8,6.8
  Bottom 0.2: v4.8,6.8 2.46,9.14 LED.2
N$6
  Top 0.305: TO_SENSOR_BOARD2.6 48.02,12.63 FERRITEBEAD.P$1 GND_JUMPER.2
N$12
  Top 0.2: LED2.A 10.6,43.75 10.55,43.8 R11.1
N$16
  Top 0.203: CBOOT.1 13.66,53.5 VREG.1
N$17
  pour Top (no thermals): 12.2,49.2 14.3,49.2 15,48.5 16.7,48.5 16.7,54.2 15.6,54.2 15.6,53.4 12.5,50.3 12.2,50.3
RTC_INT  (via drill 0.35, 0.4)
  Top 0.2: SWITCH.3 17.14,23.43 24.1,23.43 | v28.3,44.8 28.3,44.55 27.99,44.24 | 26.34,30.61 26.34,31.84 v28.8,34.3
  Top 0.203: RTC.3 25.88,25.2 24.1,23.43 | RTC.3 26.34,25.2 26.34,30.61 | RTC.3 29.8,25.2 31.6,23.4 31.6,22.2 v33,20.8 | v39.2,19.4 41.43,19.4 41.65,19.18 45.62,19.18 46.41,18.39 46.41,17.04 48,15.45 TO_SENSOR_BOARD2.5 51,12.19 EXTERNAL_INT.2 | v26.1,48.23 26.1,48.37 24.33,50.14 MS1.6 | v26.4,36.1 26.4,37.41 27.99,39 27.99,44.24
  Bottom 0.152: v26.4,36.1 27,36.1 v28.8,34.3
  Bottom 0.2: v28.3,44.8 27.69,45.41 27.49,45.41
  Bottom 0.203: v33,20.8 37.8,20.8 v39.2,19.4 | v26.1,48.23 26.2,48.13 26.2,46.7 27.49,45.41
SCK  (via drill 0.35, 0.4)
  Top 0.2: MS1.11 15.3,29.41 15.3,28.6 v15.4,28.5 | v18,15.4 19,15.4 22.2,12.2 24.01,12.2 24.99,11.22 24.99,11.21 29.4,6.8 MICROSD.5
  Bottom 0.2: v18,15.4 15.77,17.63 15.77,22.12 15.4,22.49 v15.4,28.5
SCL
  Top 0.2: RTC.16 37.35,27.91 39.04,27.91 40.12,29 R3.1 40.12,30.17 43.02,27.28 MS1.18
  Bottom 0.254: TO_SENSOR_BOARD1.1 46,55.35 46,29.63 MS1.18
SDA
  Top 0.2: R5.1 40.12,32.4 39.02,31.3 39.02,29.46 38.07,28.51 36.27,28.51 35.9,28.14 35.9,26.86 36.43,26.33 37.04,26.33 RTC.15
  Top 0.203: RTC.15 41.91,26.48 MS1.17
  Bottom 0.254: TO_SENSOR_BOARD1.2 46.5,53.31 46.5,27.5 43.74,24.74 MS1.17
SENSOR1  (via drill 0.4)
  Top 0.2: v26.4,43.66 24.73,43.66 MS1.8 | TO_SENSOR_BOARD1.5 45,47.19 44.06,46.25 43.16,46.25 41.37,44.46 29.9,44.46 v29.3,43.86
  Bottom 0.2: v29.3,43.86 29.1,43.66 v26.4,43.66
SENSOR2  (via drill 0.4)
  Top 0.2: v26.4,42.12 23.73,42.12 MS1.9 | TO_SENSOR_BOARD1.6 44.92,44.65 44.04,43.77 30.45,43.77 v28.8,42.12
  Bottom 0.2: v26.4,42.12 v28.8,42.12
SHIFT_CLK  (via drill 0.4)
  Top 0.2: TO_POWER_BOARD.7 12.47,33.73 13.18,33.02 14.82,33.02 22.14,40.34 22.14,40.47 22.84,41.17 26.87,41.17 v26.9,41.2 | v32,41.3 42.33,41.3 MS1.23
  Bottom 0.2: v26.9,41.2 27,41.3 v32,41.3
SHIFT_DATA  (via drill 0.4)
  Top 0.2: TO_POWER_BOARD.6 12.47,36.27 13.18,36.98 18.05,36.98 22.14,41.07 22.14,43.01 22.84,43.71 23.82,43.71 24.63,42.9 v26.9,42.9 | MS1.24 43.63,42.5 v30.4,42.5
  Bottom 0.2: v26.9,42.9 30,42.9 v30.4,42.5
SHIFT_LATCH
  Top 0.2: MS1.21 42.65,35.9 37.9,35.9 35.92,37.88 29.88,37.88 24.52,32.52 24.52,31.67 23.86,31.01 22.84,31.01 19.6,27.77 15.24,27.77 14.36,28.65 TO_POWER_BOARD.9
SHUTDOWN  (via drill 0.35, 0.4)
  Top 0.203: R8.2 35.82,60.92 C2.2 33.83,60.9 D-FLIPFLOP.1 33.68,60.75 33.68,61.88 32.54,63.02 27.62,63.02 v27.1,62.5 | MS1.5 25.36,54.71 25.36,55.07 27.12,56.83 v27.12,58.5
  Bottom 0.203: v27.1,62.5 27.1,60.35 27.12,60.33 v27.12,58.5
WAKE_NOSLEEP  (via drill 0.35, 0.4)
  Top 0.2: MS1.10 14.4,31.05 v14.4,29.5 | P_MOS.1 9.37,17.97 v9.4,18 13.72,18 SWITCH.2
  Bottom 0.2: v14.4,29.5 14.4,22.82 14.23,22.65 12.49,22.65 11.77,21.92 11.77,20.18 9.59,18 v9.4,18

### Text on the board
tPlace: Not-Gate | SCL | SDA | +3V | Sen1 | Sen2 | 5V | Optional / I2C / Pull up | 3V3 | +5V | +3V3 | !CLR | EX / INT | G | GND
bPlace: GND | Logic Module V3 | Bao Nguyen | OPEnSLab | Kawin Pechetratanapanit | +12V | GND | GND | +5V | Shift_D | Shift_Ck | +3V3 | Shift_L | HB_IN1 | HB_IN2